# Altium schematic sheet interface1.SchDoc
size A
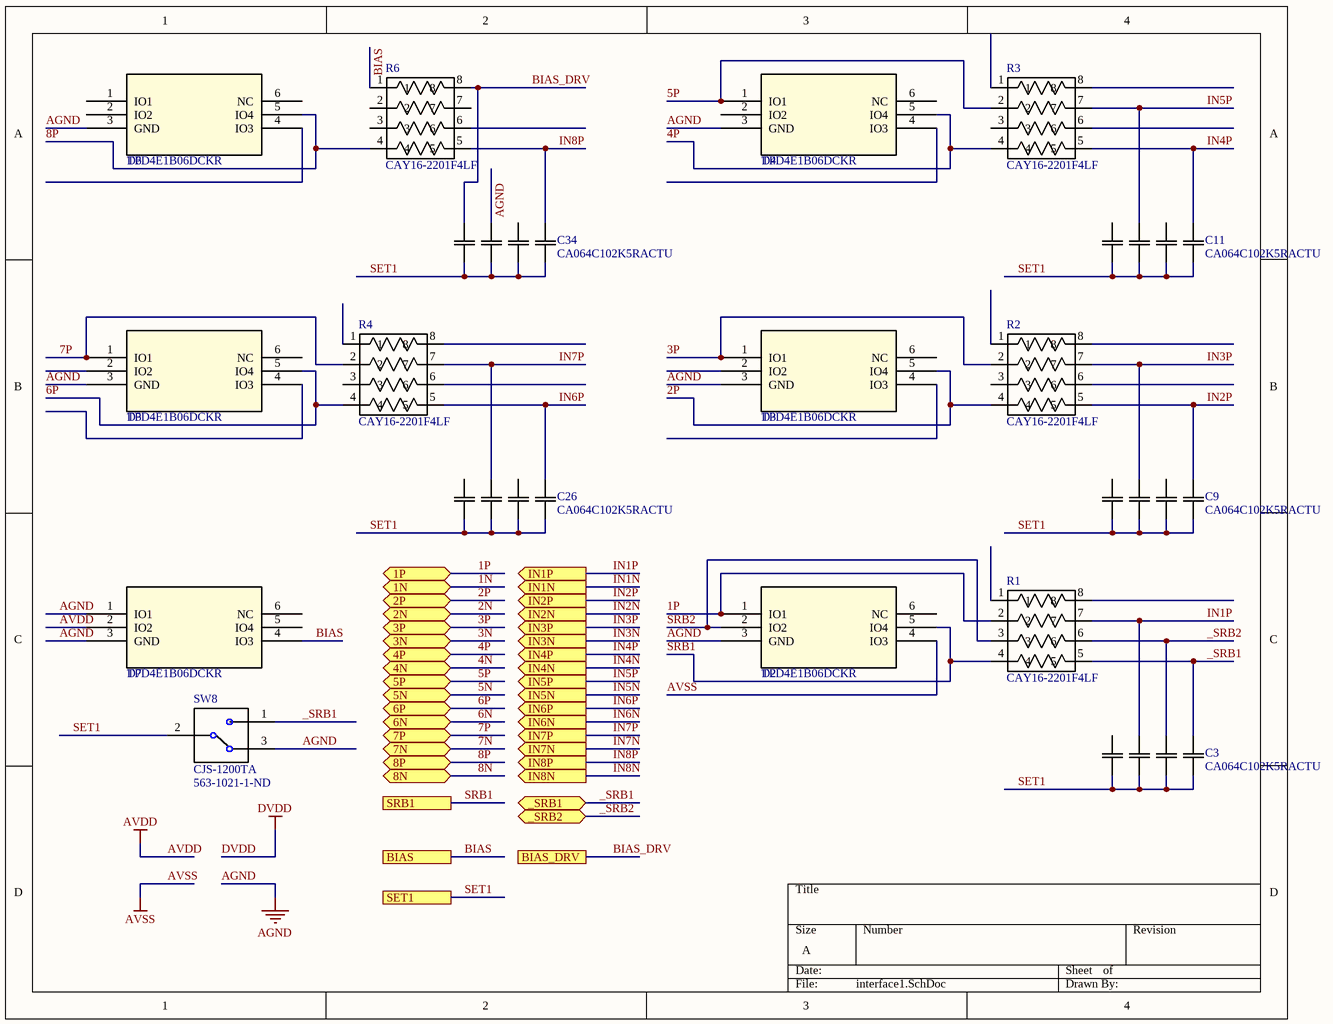
[diagram p0: interface1.SchDoc]

## Parts
C3  CA064C102K5RACTU  [CA064]
C9  CA064C102K5RACTU  [CA064]
C11  CA064C102K5RACTU  [CA064]
C26  CA064C102K5RACTU  [CA064]
C34  CA064C102K5RACTU  [CA064]
D2  TPD4E1B06DCKR  [DCK6]
D3  TPD4E1B06DCKR  [DCK6]
D4  TPD4E1B06DCKR  [DCK6]
D5  TPD4E1B06DCKR  [DCK6]
D6  TPD4E1B06DCKR  [DCK6]
D7  TPD4E1B06DCKR  [DCK6]
R1  CAY16-2201F4LF  [*RESCAXE80P320X160-8N]
R2  CAY16-2201F4LF  [*RESCAXE80P320X160-8N]
R3  CAY16-2201F4LF  [*RESCAXE80P320X160-8N]
R4  CAY16-2201F4LF  [*RESCAXE80P320X160-8N]
R6  CAY16-2201F4LF  [*RESCAXE80P320X160-8N]
SW8  CJS-1200TA  Supplier Part Number 1: 563-1021-1-ND  [*SW_CJS-1200TA]

## Ports
1N (bidir), 1P (bidir), 2N (bidir), 2P (bidir), 3N (bidir), 3P (bidir), 4N (bidir), 4P (bidir), 5N (bidir), 5P (bidir), 6N (bidir), 6P (bidir), 7N (bidir), 7P (bidir), 8N (bidir), 8P (bidir), _SRB1 (bidir), _SRB2 (bidir), BIAS, BIAS_DRV, IN1N (out), IN1P (out), IN2N (out), IN2P (out), IN3N (out), IN3P (out), IN4N (out), IN4P (out), IN5N (out), IN5P (out), IN6N (out), IN6P (out), IN7N (out), IN7P (out), IN8N (out), IN8P (out), SET1, SRB1

## Nets
AGND: C34.7 D2.3(GND) D3.3(GND) D4.3(GND) D5.3(GND) D6.3(GND) D7.1(IO1) D7.3(GND) SW8.3
AVDD: D7.2(IO2)
AVSS: D2.4(IO3)
1N: port 1N
1P: D2.1(IO1) R1.2 ; port 1P
2N: port 2N
2P: D3.5(IO4) R2.4 ; port 2P
3N: port 3N
3P: D3.1(IO1) R2.2 ; port 3P
4N: port 4N
4P: D4.5(IO4) R3.4 ; port 4P
5N: port 5N
5P: D4.1(IO1) R3.2 ; port 5P
6N: port 6N
6P: D5.5(IO4) R4.4 ; port 6P
7N: port 7N
7P: D5.1(IO1) R4.2 ; port 7P
8N: port 8N
8P: D6.5(IO4) R6.4 ; port 8P
_SRB1: C3.5 R1.5 SW8.1 ; port _SRB1
_SRB2: C3.6 R1.6 ; port _SRB2
BIAS: D7.4(IO3) R6.1 ; port BIAS
BIAS_DRV: C34.8 R6.8 ; port BIAS_DRV
IN1N: port IN1N
IN1P: C3.7 R1.7 ; port IN1P
IN2N: port IN2N
IN2P: C9.5 R2.5 ; port IN2P
IN3N: port IN3N
IN3P: C9.7 R2.7 ; port IN3P
IN4N: port IN4N
IN4P: C11.5 R3.5 ; port IN4P
IN5N: port IN5N
IN5P: C11.7 R3.7 ; port IN5P
IN6N: port IN6N
IN6P: C26.5 R4.5 ; port IN6P
IN7N: port IN7N
IN7P: C26.7 R4.7 ; port IN7P
IN8N: port IN8N
IN8P: C34.5 R6.5 ; port IN8P
SET1: C3.1 C3.2 C3.3 C3.4 C9.1 C9.2 C9.3 C9.4 C11.1 C11.2 C11.3 C11.4 C26.1 C26.2 C26.3 C26.4 C34.1 C34.2 C34.3 C34.4 SW8.2 ; port SET1
SRB1: D2.5(IO4) R1.4 ; port SRB1
SRB2: D2.2(IO2) R1.3

Not connected (* = marked no-connect by the designer): C3 8; C9 6 8; C11 6 8; C26 6 8; C34 6; D2 6(NC); D3 2(IO2) 4(IO3) 6(NC); D4 2(IO2) 4(IO3) 6(NC); D5 2(IO2) 4(IO3) 6(NC); D6 1(IO1) 2(IO2) 4(IO3) 6(NC); D7 5(IO4) 6(NC); R1 1 8; R2 1 3 6 8; R3 1 3 6 8; R4 1 3 6 8; R6 2 3 6 7

## Library data of the parts
C3 C9 C11 C26 C34 = CA064C102K5RACTU: CAP ARRAY 1000PF 50V X7R 0612; Manufacturer 1: KEMET; Dielectric Material: Ceramic; Capacitance: 1nF; Tolerance: 10%; Number of Capacitors: 4; Circuit Type: Isolated; Supplier 1: Digi-Key; Manufacturer Part Number 1: CA064C102K5RACTU; Stock 1: 12; Pricing 1: 1=0.61000, 10=0.42800, 100=0.28180, 500=0.20874, 1000=0.17743 (USD); RoHS: Yes; Mount: Surface Mount; Case/Package: 0612; Case Code (Metric): 1632; Case Code (Imperial): 0612; Contact Plating: Tin,Matte; Number of Terminals: 8; Min Operating Temperature: -55°C; Max Operating Temperature: 125°C; Packaging: Tape and Reel; Package Quantity: 4000; Voltage Rating: 50V; Dielectric: X7R; Termination: SMD/SMT; Number of Elements: 4; Voltage Rating (DC): 50V; Number of Circuits: 4; Length: 0.063inch; Height: 0.8mm; Width: 1.6mm; Height - Seated (Max): 0.035inch; Terminal Pitch: 0.8mm; REACH SVHC: No SVHC; Lead Free: Lead Free; ComponentLink1URL: http://www.farnell.com/datasheets/1868478.pdf?src-supplier=Farnell; ComponentLink1Description: http://www.farnell.com/datasheets/1868478.pdf?src-supplier=Farnell; ComponentLink2URL: https://media.digikey.com/pdf/Data%20Sheets/Kemet%20PDFs/X7R_Dielectric_10-200V_Rev_Nov2013.pdf?src-supplier=Digi-Key; ComponentLink2Description: https://media.digikey.com/pdf/Data%20Sheets/Kemet%20PDFs/X7R_Dielectric_10-200V_Rev_Nov2013.pdf?src-supplier=Digi-Key; ComponentLink3URL: http://www.mouser.com/ds/2/212/KEM_C1017_X7R_ARRAY_SMD-1102778.pdf?src-supplier=Mouser; ComponentLink3Description: http://www.mouser.com/ds/2/212/KEM_C1017_X7R_ARRAY_SMD-1102778.pdf?src-supplier=Mouser; ComponentLink4URL: http://www.farnell.com/datasheets/1868478.pdf?src-supplier=Element14; ComponentLink4Description: http://www.farnell.com/datasheets/1868478.pdf?src-supplier=Element14; ComponentLink5URL: http://capacitoredge.kemet.com/capedge2/DataSheet/Datasheet-CA064C102K5RACTU.pdf?pn=CA064C102K5RACTU&src-supplier=Avnet; ComponentLink5Description: http://capacitoredge.kemet.com/capedge2/DataSheet/Datasheet-CA064C102K5RACTU.pdf?pn=CA064C102K5RACTU&src-supplier=Avnet; ComponentLink6URL: http://capacitoredge.kemet.com/capedge2/DataSheet/Datasheet-CA064C102K5RACTU.pdf?pn=CA064C102K5RACTU&src-supplier=Avnet+Asia; ComponentLink6Description: http://capacitoredge.kemet.com/capedge2/DataSheet/Datasheet-CA064C102K5RACTU.pdf?pn=CA064C102K5RACTU&src-supplier=Avnet+Asia; Supplier Part Number 1: 399-9415-1-ND
D2-D7 = TPD4E1B06DCKR: TVS DIODE 5.5VWM 14.5VC SC70-6; Manufacturer 1: Texas Instruments; Capacitance: 1pF; Operating Supply Voltage: 5.5V; Direction: Bidirectional,Unidirectional; Number of Bidirectional Channels: 4; Min Breakdown Voltage: 7V; Clamping Voltage: 14.5V; Peak Pulse Power: 45W; Power Line Protection: No; Polarity: Bidirectional; ESD Protection: Yes; Max Reverse Leakage Current: 500pA; Test Current: 1mA; Peak Pulse Current: 3A; Interface: LVDS,USB; Supplier 1: Digi-Key; Manufacturer Part Number 1: TPD4E1B06DCKR; Stock 1: 27694; Pricing 1: 1=0.58000, 10=0.49400, 100=0.36920, 500=0.29004, 1000=0.22413 (USD); RoHS: Yes; Mount: Surface Mount; Case/Package: SC; Number of Pins: 6; Min Operating Temperature: -40°C; Max Operating Temperature: 125°C; Package Quantity: 3000; Packaging: Tape and Reel; Reverse Standoff Voltage: 5.5V; Breakdown Voltage: 7V; Number of Channels: 4; Termination: SMD/SMT; Working Voltage: 5.5V; Max Power Dissipation: 45W; Length: 2.15mm; Height: 1mm; Width: 1.4mm; REACH SVHC: No SVHC; Lead Free: Lead Free; ComponentLink1URL: https://datasheet.ciiva.com/12545/tpd4e1b06-224687-12545147.pdf?src-supplier=Mouser; ComponentLink1Description: https://datasheet.ciiva.com/12545/tpd4e1b06-224687-12545147.pdf?src-supplier=Mouser; ComponentLink2URL: https://datasheet.ciiva.com/6574/tpd4e1b06-6574671.pdf?src-supplier=Digi-Key; ComponentLink2Description: https://datasheet.ciiva.com/6574/tpd4e1b06-6574671.pdf?src-supplier=Digi-Key; Supplier Part Number 1: 296-39346-1-ND
R1-R4 R6 = CAY16-2201F4LF: BOURNS         CAY16-2201F4LF             RESISTOR, ARRAY-4, 2.2KOHM, 5%, SMD; Resistance: 2.2kR; Tolerance: 1%; Power Rating: 248mW; Voltage Rating: 50V; Number of Elements: 4; Circuit Type: Isolated; Power Per Element: 62.5mW; Temperature Coefficient: 200ppm/°C; Supplier 1: Digi-Key; Manufacturer 1: Bourns; Manufacturer Part Number 1: CAY16-2201F4LF; Stock 1: 35310; Pricing 1: 1=0.14000, 10=0.12100, 25=0.08800, 50=0.06380, 100=0.04730, 250=0.03632, 500=0.02860, 1000=0.01980 (USD); RoHS: Yes; Mount: Surface Mount; Case/Package: 1206; Number of Pins: 8; Case Code (Metric): 3216; Case Code (Imperial): 1206; Number of Terminals: 8; Contact Plating: Tin; Min Operating Temperature: -55°C; Max Operating Temperature: 125°C; Packaging: Tape and Reel; Package Quantity: 1; Number of Resistors: 4; Termination: Convex; Military Standard: Not; Voltage Rating (DC): 50V; Number of Circuits: 4; Length: 3.2mm; Height: 0.024inch; Width: 0.063inch; Lead Pitch: 0.8mm; Terminal Pitch: 0.8mm; Depth: 1.6mm; REACH SVHC: No SVHC; Lead Free: Lead Free; ComponentLink1URL: https://datasheet.ciiva.com/11807/0900766b8064e462-11807027.pdf?src-supplier=RSComponents; ComponentLink1Description: https://datasheet.ciiva.com/11807/0900766b8064e462-11807027.pdf?src-supplier=RSComponents; ComponentLink2URL: https://datasheet.ciiva.com/16967/catcay-16967355.pdf?src-supplier=Avnet+Europe; ComponentLink2Description: https://datasheet.ciiva.com/16967/catcay-16967355.pdf?src-supplier=Avnet+Europe; ComponentLink3URL: https://datasheet.ciiva.com/6533/catcay-6533677.pdf?src-supplier=Digi-Key; ComponentLink3Description: https://datasheet.ciiva.com/6533/catcay-6533677.pdf?src-supplier=Digi-Key; ComponentLink4URL: https://datasheet.ciiva.com/30021/catcay-30021357.pdf?src-supplier=Avnet; ComponentLink4Description: https://datasheet.ciiva.com/30021/catcay-30021357.pdf?src-supplier=Avnet; ComponentLink5URL: https://datasheet.ciiva.com/1478/1849489-1478846.pdf?src-supplier=Element14; ComponentLink5Description: https://datasheet.ciiva.com/1478/1849489-1478846.pdf?src-supplier=Element14; ComponentLink6URL: https://datasheet.ciiva.com/6533/catcay-6533678.pdf?src-supplier=Digi-Key; ComponentLink6Description: https://datasheet.ciiva.com/6533/catcay-6533678.pdf?src-supplier=Digi-Key; ComponentLink7URL: https://datasheet.ciiva.com/1478/1849489-1478847.pdf?src-supplier=Element14; ComponentLink7Description: https://datasheet.ciiva.com/1478/1849489-1478847.pdf?src-supplier=Element14; ComponentLink8URL: https://datasheet.ciiva.com/6533/catcay-6533679.pdf?src-supplier=Digi-Key; ComponentLink8Description: https://datasheet.ciiva.com/6533/catcay-6533679.pdf?src-supplier=Digi-Key; ComponentLink9URL: https://datasheet.ciiva.com/48692/001055385-da-01-en-wid-arr-cay16-2201f4lf-2-2k-ohm-4-w-1206-48692149.pdf?src-supplier=Conrad; ComponentLink9Description: https://datasheet.ciiva.com/48692/001055385-da-01-en-wid-arr-cay16-2201f4lf-2-2k-ohm-4-w-1206-48692149.pdf?src-supplier=Conrad; Supplier Part Number 1: CAY16-2201F4LFCT-ND
SW8 = CJS-1200TA: SWITCH SLIDE SPDT 100MA 6V; Manufacturer 1: Nidec Copal; Body Material: Polyphenylene; Number of Positions: 2; Electrical Life: 200Cycles; Max Voltage Rating (DC): 24V; Actuator Type: Slide (Standard); Washable: Yes; Supplier 1: Digi-Key; Manufacturer Part Number 1: CJS-1200TA; Stock 1: 72766; Pricing 1: 1=0.88000, 10=0.86000, 25=0.81000, 50=0.76040, 100=0.72730, 250=0.69428, 500=0.62814 (USD); RoHS: Yes; Mount: Surface Mount; Contact Material: Copper Alloy; Contact Plating: Gold; Min Operating Temperature: -40°C; Max Operating Temperature: 85°C; Packaging: Tape and Reel; Throw Configuration: SPDT; Voltage Rating (DC): 6V; Current Rating: 100mA; Termination: J-Hook; Orientation: Vertical; Length: 0.212inch; Radiation Hardening: No; Lead Free: Lead Free; ComponentLink1URL: https://datasheet.ciiva.com/2864/cjs-2864476.pdf?src-supplier=Digi-Key; ComponentLink1Description: https://datasheet.ciiva.com/2864/cjs-2864476.pdf?src-supplier=Digi-Key; ComponentLink2URL: https://datasheet.ciiva.com/2864/cjs-2864477.pdf?src-supplier=Digi-Key; ComponentLink2Description: https://datasheet.ciiva.com/2864/cjs-2864477.pdf?src-supplier=Digi-Key; ComponentLink3URL: https://datasheet.ciiva.com/2864/cjs-2864478.pdf?src-supplier=Digi-Key; ComponentLink3Description: https://datasheet.ciiva.com/2864/cjs-2864478.pdf?src-supplier=Digi-Key